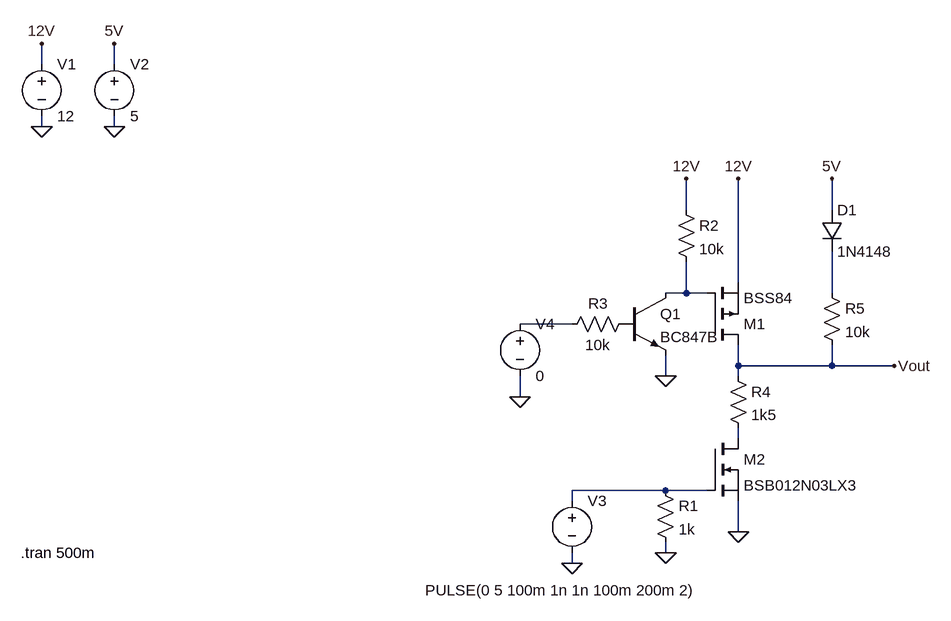
[diagram p0: schematic PGM_Supply.asc]
PGM_Supply.asc, the LTspice schematic file:
Version 4
SHEET 1 880 680
WIRE -832 -272 -832 -304
WIRE -720 -272 -720 -304
WIRE -832 -176 -832 -192
WIRE -720 -176 -720 -192
WIRE 160 -48 160 -96
WIRE 384 -48 384 -96
WIRE 240 64 240 -96
WIRE 160 80 160 32
WIRE 160 80 128 80
WIRE 192 80 160 80
WIRE 384 80 384 16
WIRE -16 128 -96 128
WIRE 240 192 240 160
WIRE 384 192 384 160
WIRE 384 192 240 192
WIRE 480 192 384 192
WIRE 128 208 128 176
WIRE 240 208 240 192
WIRE -96 240 -96 208
WIRE 240 304 240 288
WIRE 128 384 -16 384
WIRE 192 384 128 384
WIRE -16 400 -16 384
WIRE 240 448 240 400
WIRE 128 480 128 464
WIRE -16 496 -16 480
FLAG -832 -176 0
FLAG -720 -176 0
FLAG -832 -304 12V
FLAG -720 -304 5V
FLAG 240 -96 12V
FLAG 384 -96 5V
FLAG 480 192 Vout
FLAG 240 448 0
FLAG 128 480 0
FLAG -16 496 0
FLAG -96 240 0
FLAG 160 -96 12V
FLAG 128 208 0
SYMBOL pmos 192 160 M180
SYMATTR InstName M1
SYMATTR Value BSS84
SYMBOL nmos 192 304 R0
SYMATTR InstName M2
SYMATTR Value BSB012N03LX3
SYMBOL voltage -832 -288 R0
WINDOW 123 0 0 Left 0
WINDOW 39 0 0 Left 0
SYMATTR InstName V1
SYMATTR Value 12
SYMBOL voltage -720 -288 R0
WINDOW 123 0 0 Left 0
WINDOW 39 0 0 Left 0
SYMATTR InstName V2
SYMATTR Value 5
SYMBOL diode 368 -48 R0
SYMATTR InstName D1
SYMATTR Value 1N4148
SYMBOL voltage -16 384 R0
WINDOW 3 -226 154 Left 2
WINDOW 123 0 0 Left 0
WINDOW 39 0 0 Left 0
SYMATTR Value PULSE(0 5 100m 1n 1n 100m 200m 2)
SYMATTR InstName V3
SYMBOL res 112 368 R0
SYMATTR InstName R1
SYMATTR Value 1k
SYMBOL voltage -96 112 R0
WINDOW 123 0 0 Left 0
WINDOW 39 0 0 Left 0
SYMATTR InstName V4
SYMATTR Value 0
SYMBOL npn 64 80 R0
SYMATTR InstName Q1
SYMATTR Value BC847B
SYMBOL res 144 -64 R0
SYMATTR InstName R2
SYMATTR Value 10k
SYMBOL res 80 112 R90
WINDOW 0 0 56 VBottom 2
WINDOW 3 32 56 VTop 2
SYMATTR InstName R3
SYMATTR Value 10k
SYMBOL res 224 192 R0
SYMATTR InstName R4
SYMATTR Value 1k5
SYMBOL res 368 64 R0
SYMATTR InstName R5
SYMATTR Value 10k
TEXT -864 480 Left 2 !.tran 500m

The netlist it stands for:
* PGM_Supply.asc
M1 Vout N001 12V 12V BSS84
M2 N004 N005 0 0 BSB012N03LX3
V1 12V 0 12
V2 5V 0 5
D1 5V N002 1N4148
V3 N005 0 PULSE(0 5 100m 1n 1n 100m 200m 2)
R1 N005 0 1k
V4 N003 0 0
Q1 N001 P001 0 0 BC847B
R2 12V N001 10k
R3 P001 N003 10k
R4 Vout N004 1k5
R5 N002 Vout 10k
.model D D
.lib standard.dio
.model NPN NPN
.model PNP PNP
.lib standard.bjt
.model NMOS NMOS
.model PMOS PMOS
.lib standard.mos
.tran 500m
.backanno
.end